# Altium project SWD Breakout.PrjPcb
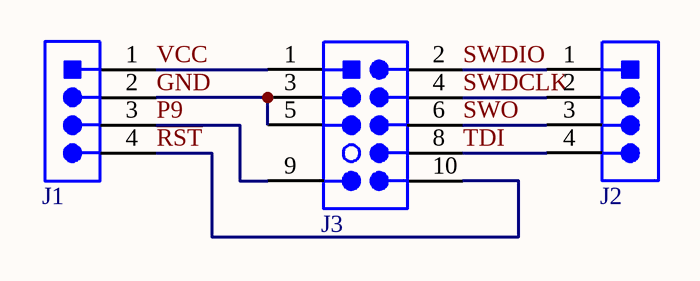
[diagram p0: SWD Breakout.SchDoc]

1 sheet, 3 parts. Net scope: global (net labels, ports and power ports of the same name join across sheets).
Board file: SWD Breakout.PcbDoc

## Sheet SWD Breakout.SchDoc
size Letter; Address4: USA

### Parts
J1  4 contacts Male header  [61300411121]  (value not drawn)
J2  4 contacts Male header  [61300411121]  (value not drawn)
J3  Cortex Debug, 0.050" 10 Pin  [FTSH-105-01-F-DV-007-K PLUGIN]  (value not drawn)

### Nets
~{RST}: J1.4 J3.10(~{RESET})
GND: J1.2 J3.3(GND) J3.5(GND)
P9: J1.3 J3.9(GNDDetect)
SWDCLK: J2.2 J3.4(SWDCLK/TCK)
SWDIO: J2.1 J3.2(SWDIO/TMS)
SWO: J2.3 J3.6(SWO/TDO)
TDI: J2.4 J3.8(NC/TDI)
VCC: J1.1 J3.1(VCC)

### Notes on the sheet
- Title:
- Desc:
- Size:
- Date:
- File:
- Repo:
- Letter
- Auth:
- Time:
- Sheet
- Proj:
- of

### Library data of the parts
J1 J2 = 61300411121: Connector Male Header 1X4 vertical 4contacts 0.100in pitch 30uin Gold finish TH; Manufacturer: Würth Elektronik; Description in Visual: Con Hdr Male 4contacts vertical 1X4; Number of Contacts: 4; P/N: 61300411121; Manufacturer P/N: 61300411121; Orientation: vertical; Number of Rows: 1.00; Pitch: 0.100in; Contact Finish: Gold; Gender: Male; ComponentLink1Description: Manufacturer Website; ComponentLink1URL: https://www.we-online.com/web/en/wuerth_elektronik/start.php; ComponentLink2Description: Component Datasheet; ComponentLink2URL: https://www.we-online.de/katalog/datasheet/6130xx11121.pdf; ComponentLink3Description: Octopart Link; ComponentLink3URL: https://octopart.com/61300411121-w%C3%BCrth+elektronik-32855522?r=sp
J3 = ARM Cortex Debug: 10 Pin Shrouded Header, 0.050", Key Pin 7; Manufacturer: Samtech; Manufacturer P/N: Various; Number of Contacts: 10; Gender: Male; P/N: ARM Cortex Debug; Description in Visual: 10 Pin Shrouded Header, 0.050", Key Pin 7; Orientation: Vertical; Number of Rows: 2; Pitch: 0.050"; Contact Finish: Gold; ComponentLink1Description: Pinout Reference; ComponentLink1URL: http://infocenter.arm.com/help/topic/com.arm.doc.faqs/attached/13634/cortex_debug_connectors.pdf; ComponentLink2Description: Datasheet for Connector; ComponentLink2URL: http://suddendocs.samtec.com/catalog_english/ftsh_smt.pdf; Supplier 3: Digi-Key; Supplier Part Number 3: SAM11250-ND; Supplier 1: Digi-Key; Supplier Part Number 1: SAM15640-ND; Supplier 2: Digi-Key; Supplier Part Number 2: SAM13926CT-ND